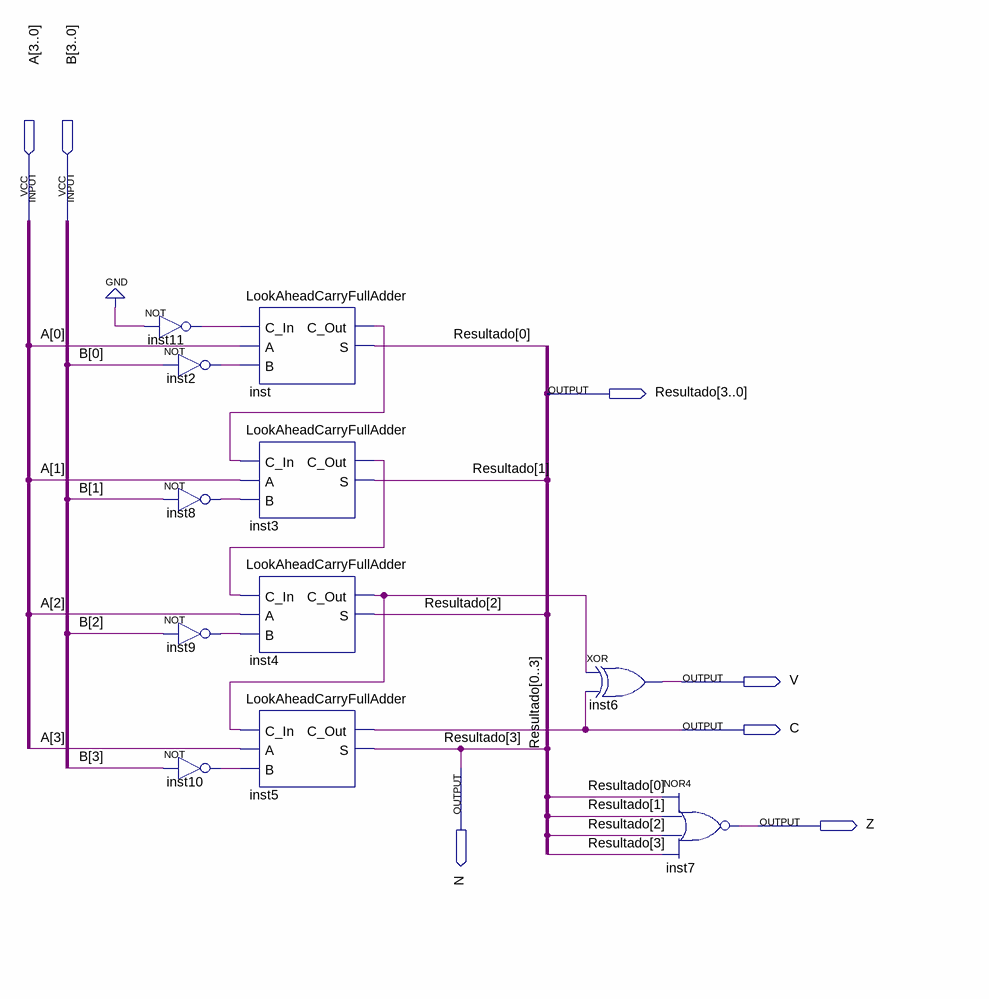
[diagram p0: schematic sheet]
// Quartus schematic AsubB.bdf as structural Verilog: 11 symbols, 7 pins
module AsubB (
  input  [3:0] A,
  input  [3:0] B,
  output [3:0] Resultado,
  output V,
  output C,
  output N,
  output Z
);

  wire inst2_out, inst3_c_out, inst4_c_out, inst8_out, inst9_out, inst10_out, inst11_out, inst_c_out;

  not inst11 (inst11_out, 1'b0);
  not inst2 (inst2_out, B[0]);
  not inst8 (inst8_out, B[1]);
  not inst9 (inst9_out, B[2]);
  not inst10 (inst10_out, B[3]);
  LookAheadCarryFullAdder inst (.C_In(inst11_out), .A(A[0]), .B(inst2_out), .C_Out(inst_c_out), .S(Resultado[0]));
  LookAheadCarryFullAdder inst3 (.C_In(inst_c_out), .A(A[1]), .B(inst8_out), .C_Out(inst3_c_out), .S(Resultado[1]));
  LookAheadCarryFullAdder inst4 (.C_In(inst3_c_out), .A(A[2]), .B(inst9_out), .C_Out(inst4_c_out), .S(Resultado[2]));
  LookAheadCarryFullAdder inst5 (.C_In(inst4_c_out), .A(A[3]), .B(inst10_out), .C_Out(C), .S(N));
  xor inst6 (V, inst4_c_out, C);
  nor inst7 (Z, Resultado[0], Resultado[1], Resultado[2], N);

  assign Resultado[3] = N;
endmodule
